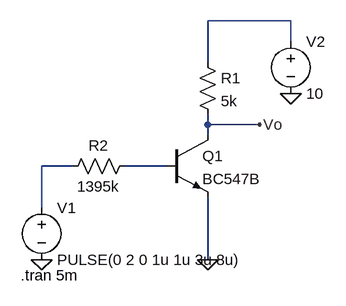
[diagram p0: schematic lab3.4b.asc]
lab3.4b.asc, the LTspice schematic file:
Version 4
SHEET 1 880 680
WIRE 160 -144 32 -144
WIRE 160 -112 160 -144
WIRE 32 -80 32 -144
WIRE 32 16 32 0
WIRE 112 16 32 16
WIRE 32 32 32 16
WIRE -176 80 -224 80
WIRE -32 80 -96 80
WIRE -224 144 -224 80
WIRE 32 224 32 128
FLAG 160 -32 0
FLAG -224 224 0
FLAG 32 224 0
FLAG 112 16 Vo
SYMBOL npn -32 32 R0
SYMATTR InstName Q1
SYMATTR Value BC547B
SYMBOL res 16 -96 R0
SYMATTR InstName R1
SYMATTR Value 5k
SYMBOL voltage -224 128 R0
WINDOW 123 0 0 Left 0
WINDOW 39 0 0 Left 0
SYMATTR InstName V1
SYMATTR Value PULSE(0 2 0 1u 1u 3u 8u)
SYMBOL voltage 160 -128 R0
WINDOW 123 0 0 Left 0
WINDOW 39 0 0 Left 0
SYMATTR InstName V2
SYMATTR Value 10
SYMBOL res -80 64 R90
WINDOW 0 0 56 VBottom 2
WINDOW 3 32 56 VTop 2
SYMATTR InstName R2
SYMATTR Value 1395k
TEXT -256 248 Left 2 !.tran 5m

The netlist it stands for:
* lab3.4b.asc
Q1 Vo N003 0 0 BC547B
R1 N001 Vo 5k
V1 N002 0 PULSE(0 2 0 1u 1u 3u 8u)
V2 N001 0 10
R2 N003 N002 1395k
.model NPN NPN
.model PNP PNP
.lib standard.bjt
.tran 5m
.backanno
.end